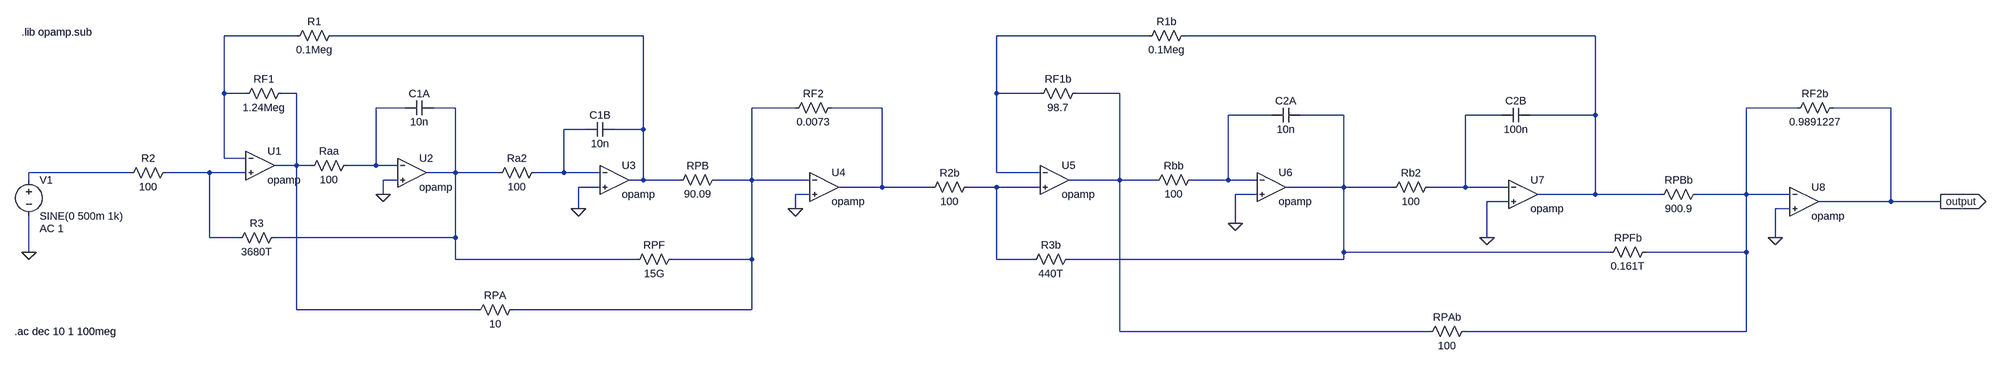
[diagram p0: schematic filtroRF.asc]
filtroRF.asc, the LTspice schematic file:
Version 4
SHEET 1 3928 680
WIRE 32 -96 -128 -96
WIRE 800 -96 112 -96
WIRE 1936 -96 1600 -96
WIRE 2960 -96 2016 -96
WIRE -128 32 -128 -96
WIRE -80 32 -128 32
WIRE 32 32 0 32
WIRE 1600 32 1600 -96
WIRE 1696 32 1600 32
WIRE 1872 32 1776 32
WIRE 272 64 208 64
WIRE 384 64 336 64
WIRE 1136 64 1040 64
WIRE 1328 64 1216 64
WIRE 3456 64 3344 64
WIRE 3664 64 3536 64
WIRE 2208 80 2112 80
WIRE 2368 80 2272 80
WIRE 2752 80 2672 80
WIRE 2960 80 2960 -96
WIRE 2960 80 2816 80
WIRE 672 112 624 112
WIRE 800 112 800 -96
WIRE 800 112 736 112
WIRE -128 176 -128 32
WIRE -80 176 -128 176
WIRE 32 192 32 32
WIRE 32 192 -16 192
WIRE 64 192 32 192
WIRE 208 192 208 64
WIRE 208 192 144 192
WIRE 256 192 208 192
WIRE -336 208 -560 208
WIRE -160 208 -256 208
WIRE -80 208 -160 208
WIRE 384 208 384 64
WIRE 384 208 320 208
WIRE 480 208 384 208
WIRE 624 208 624 112
WIRE 624 208 560 208
WIRE 704 208 624 208
WIRE 1600 208 1600 32
WIRE 1696 208 1600 208
WIRE -560 224 -560 208
WIRE 256 224 224 224
WIRE 800 224 800 112
WIRE 800 224 768 224
WIRE 880 224 800 224
WIRE 1040 224 1040 64
WIRE 1040 224 960 224
WIRE 1168 224 1040 224
WIRE 1872 224 1872 32
WIRE 1872 224 1760 224
WIRE 1952 224 1872 224
WIRE 2112 224 2112 80
WIRE 2112 224 2032 224
WIRE 2176 224 2112 224
WIRE 704 240 656 240
WIRE 1328 240 1328 64
WIRE 1328 240 1232 240
WIRE 1456 240 1328 240
WIRE 1600 240 1536 240
WIRE 1696 240 1600 240
WIRE 2368 240 2368 80
WIRE 2368 240 2240 240
WIRE 2512 240 2368 240
WIRE 2672 240 2672 80
WIRE 2672 240 2592 240
WIRE 2768 240 2672 240
WIRE 224 256 224 224
WIRE 1168 256 1136 256
WIRE 2176 256 2128 256
WIRE 2960 256 2960 80
WIRE 2960 256 2832 256
WIRE 3104 256 2960 256
WIRE 3344 256 3344 64
WIRE 3344 256 3184 256
WIRE 3440 256 3344 256
WIRE 2768 272 2720 272
WIRE 3664 272 3664 64
WIRE 3664 272 3504 272
WIRE 3792 272 3664 272
WIRE 656 288 656 240
WIRE 1136 288 1136 256
WIRE 3440 288 3408 288
WIRE 2128 320 2128 256
WIRE -160 352 -160 208
WIRE -96 352 -160 352
WIRE 384 352 384 208
WIRE 384 352 -16 352
WIRE 2720 352 2720 272
WIRE 3408 352 3408 288
WIRE -560 384 -560 304
WIRE 2368 384 2368 240
WIRE 2992 384 2368 384
WIRE 3344 384 3344 256
WIRE 3344 384 3072 384
WIRE 384 400 384 352
WIRE 784 400 384 400
WIRE 1040 400 1040 224
WIRE 1040 400 864 400
WIRE 1600 400 1600 240
WIRE 1680 400 1600 400
WIRE 2368 400 2368 384
WIRE 2368 400 1760 400
WIRE 32 512 32 192
WIRE 432 512 32 512
WIRE 1040 512 1040 400
WIRE 1040 512 512 512
WIRE 1872 560 1872 224
WIRE 2592 560 1872 560
WIRE 3344 560 3344 384
WIRE 3344 560 2672 560
FLAG 224 256 0
FLAG 656 288 0
FLAG 1136 288 0
FLAG -560 384 0
FLAG 2128 320 0
FLAG 2720 352 0
FLAG 3408 352 0
FLAG 3792 272 output
IOPIN 3792 272 Out
SYMBOL OpAmps\\opamp -48 128 R0
SYMATTR InstName U1
SYMBOL OpAmps\\opamp 288 144 R0
SYMATTR InstName U2
SYMBOL res -240 192 R90
WINDOW 0 0 56 VBottom 2
WINDOW 3 32 56 VTop 2
SYMATTR InstName R2
SYMATTR Value 100
SYMBOL res 16 16 R90
WINDOW 0 0 56 VBottom 2
WINDOW 3 32 56 VTop 2
SYMATTR InstName RF1
SYMATTR Value 1.24Meg
SYMBOL res 128 -112 R90
WINDOW 0 0 56 VBottom 2
WINDOW 3 32 56 VTop 2
SYMATTR InstName R1
SYMATTR Value 0.1Meg
SYMBOL res 0 336 R90
WINDOW 0 0 56 VBottom 2
WINDOW 3 32 56 VTop 2
SYMATTR InstName R3
SYMATTR Value 3680T
SYMBOL res 160 176 R90
WINDOW 0 0 56 VBottom 2
WINDOW 3 32 56 VTop 2
SYMATTR InstName Raa
SYMATTR Value 100
SYMBOL cap 336 48 R90
WINDOW 0 0 32 VBottom 2
WINDOW 3 32 32 VTop 2
SYMATTR InstName C1A
SYMATTR Value 10n
SYMBOL res 576 192 R90
WINDOW 0 0 56 VBottom 2
WINDOW 3 32 56 VTop 2
SYMATTR InstName Ra2
SYMATTR Value 100
SYMBOL cap 736 96 R90
WINDOW 0 0 32 VBottom 2
WINDOW 3 32 32 VTop 2
SYMATTR InstName C1B
SYMATTR Value 10n
SYMBOL OpAmps\\opamp 736 160 R0
SYMATTR InstName U3
SYMBOL res 976 208 R90
WINDOW 0 0 56 VBottom 2
WINDOW 3 32 56 VTop 2
SYMATTR InstName RPB
SYMATTR Value 90.09
SYMBOL res 528 496 R90
WINDOW 0 0 56 VBottom 2
WINDOW 3 32 56 VTop 2
SYMATTR InstName RPA
SYMATTR Value 10
SYMBOL res 1232 48 R90
WINDOW 0 0 56 VBottom 2
WINDOW 3 32 56 VTop 2
SYMATTR InstName RF2
SYMATTR Value 0.0073
SYMBOL OpAmps\\opamp 1200 176 R0
SYMATTR InstName U4
SYMBOL voltage -560 208 R0
WINDOW 123 24 124 Left 2
WINDOW 39 0 0 Left 0
SYMATTR Value2 AC 1
SYMATTR InstName V1
SYMATTR Value SINE(0 500m 1k)
SYMBOL res 1552 224 R90
WINDOW 0 0 56 VBottom 2
WINDOW 3 32 56 VTop 2
SYMATTR InstName R2b
SYMATTR Value 100
SYMBOL OpAmps\\opamp 1728 160 R0
SYMATTR InstName U5
SYMBOL res 1792 16 R90
WINDOW 0 0 56 VBottom 2
WINDOW 3 32 56 VTop 2
SYMATTR InstName RF1b
SYMATTR Value 98.7
SYMBOL res 2048 208 R90
WINDOW 0 0 56 VBottom 2
WINDOW 3 32 56 VTop 2
SYMATTR InstName Rbb
SYMATTR Value 100
SYMBOL res 2032 -112 R90
WINDOW 0 0 56 VBottom 2
WINDOW 3 32 56 VTop 2
SYMATTR InstName R1b
SYMATTR Value 0.1Meg
SYMBOL OpAmps\\opamp 2208 176 R0
SYMATTR InstName U6
SYMBOL cap 2272 64 R90
WINDOW 0 0 32 VBottom 2
WINDOW 3 32 32 VTop 2
SYMATTR InstName C2A
SYMATTR Value 10n
SYMBOL res 1776 384 R90
WINDOW 0 0 56 VBottom 2
WINDOW 3 32 56 VTop 2
SYMATTR InstName R3b
SYMATTR Value 440T
SYMBOL res 2608 224 R90
WINDOW 0 0 56 VBottom 2
WINDOW 3 32 56 VTop 2
SYMATTR InstName Rb2
SYMATTR Value 100
SYMBOL cap 2816 64 R90
WINDOW 0 0 32 VBottom 2
WINDOW 3 32 32 VTop 2
SYMATTR InstName C2B
SYMATTR Value 100n
SYMBOL OpAmps\\opamp 2800 192 R0
SYMATTR InstName U7
SYMBOL res 3200 240 R90
WINDOW 0 0 56 VBottom 2
WINDOW 3 32 56 VTop 2
SYMATTR InstName RPBb
SYMATTR Value 900.9
SYMBOL res 2688 544 R90
WINDOW 0 0 56 VBottom 2
WINDOW 3 32 56 VTop 2
SYMATTR InstName RPAb
SYMATTR Value 100
SYMBOL OpAmps\\opamp 3472 208 R0
SYMATTR InstName U8
SYMBOL res 3552 48 R90
WINDOW 0 0 56 VBottom 2
WINDOW 3 32 56 VTop 2
SYMATTR InstName RF2b
SYMATTR Value 0.9891227
SYMBOL res 3088 368 R90
WINDOW 0 0 56 VBottom 2
WINDOW 3 32 56 VTop 2
SYMATTR InstName RPFb
SYMATTR Value 0.161T
SYMBOL res 880 384 R90
WINDOW 0 0 56 VBottom 2
WINDOW 3 32 56 VTop 2
SYMATTR InstName RPF
SYMATTR Value 15G
TEXT -576 -104 Left 2 !.lib opamp.sub
TEXT -592 560 Left 2 !.ac dec 10 1 100meg

The netlist it stands for:
* filtroRF.asc
XU1 N001 N017 N005 opamp Aol=100K GBW=10Meg  ; pins invin noninvin out
XU2 N007 0 N008 opamp Aol=100K GBW=10Meg  ; pins invin noninvin out
R2 N017 N016 100
RF1 N005 N001 1.24Meg
R1 N002 N001 0.1Meg
R3 N008 N017 3680T
Raa N007 N005 100
C1A N008 N007 10n
Ra2 N015 N008 100
C1B N002 N015 10n
XU3 N015 0 N002 opamp Aol=100K GBW=10Meg  ; pins invin noninvin out
RPB N009 N002 90.09
RPA N009 N005 10
RF2 N010 N009 0.0073
XU4 N009 0 N010 opamp Aol=100K GBW=10Meg  ; pins invin noninvin out
V1 N016 0 SINE(0 500m 1k) AC 1
R2b N018 N010 100
XU5 N003 N018 N006 opamp Aol=100K GBW=10Meg  ; pins invin noninvin out
RF1b N006 N003 98.7
Rbb N012 N006 100
R1b N004 N003 0.1Meg
XU6 N012 0 N013 opamp Aol=100K GBW=10Meg  ; pins invin noninvin out
C2A N013 N012 10n
R3b N013 N018 440T
Rb2 N014 N013 100
C2B N004 N014 100n
XU7 N014 0 N004 opamp Aol=100K GBW=10Meg  ; pins invin noninvin out
RPBb N011 N004 900.9
RPAb N011 N006 100
XU8 N011 0 output opamp Aol=100K GBW=10Meg  ; pins invin noninvin out
RF2b output N011 0.9891227
RPFb N011 N013 0.161T
RPF N009 N008 15G
.lib opamp.sub
.ac dec 10 1 100meg
.backanno
.end